# Altium schematic sheet STM32F103VC+NAND_Flash.SchDoc
size A4
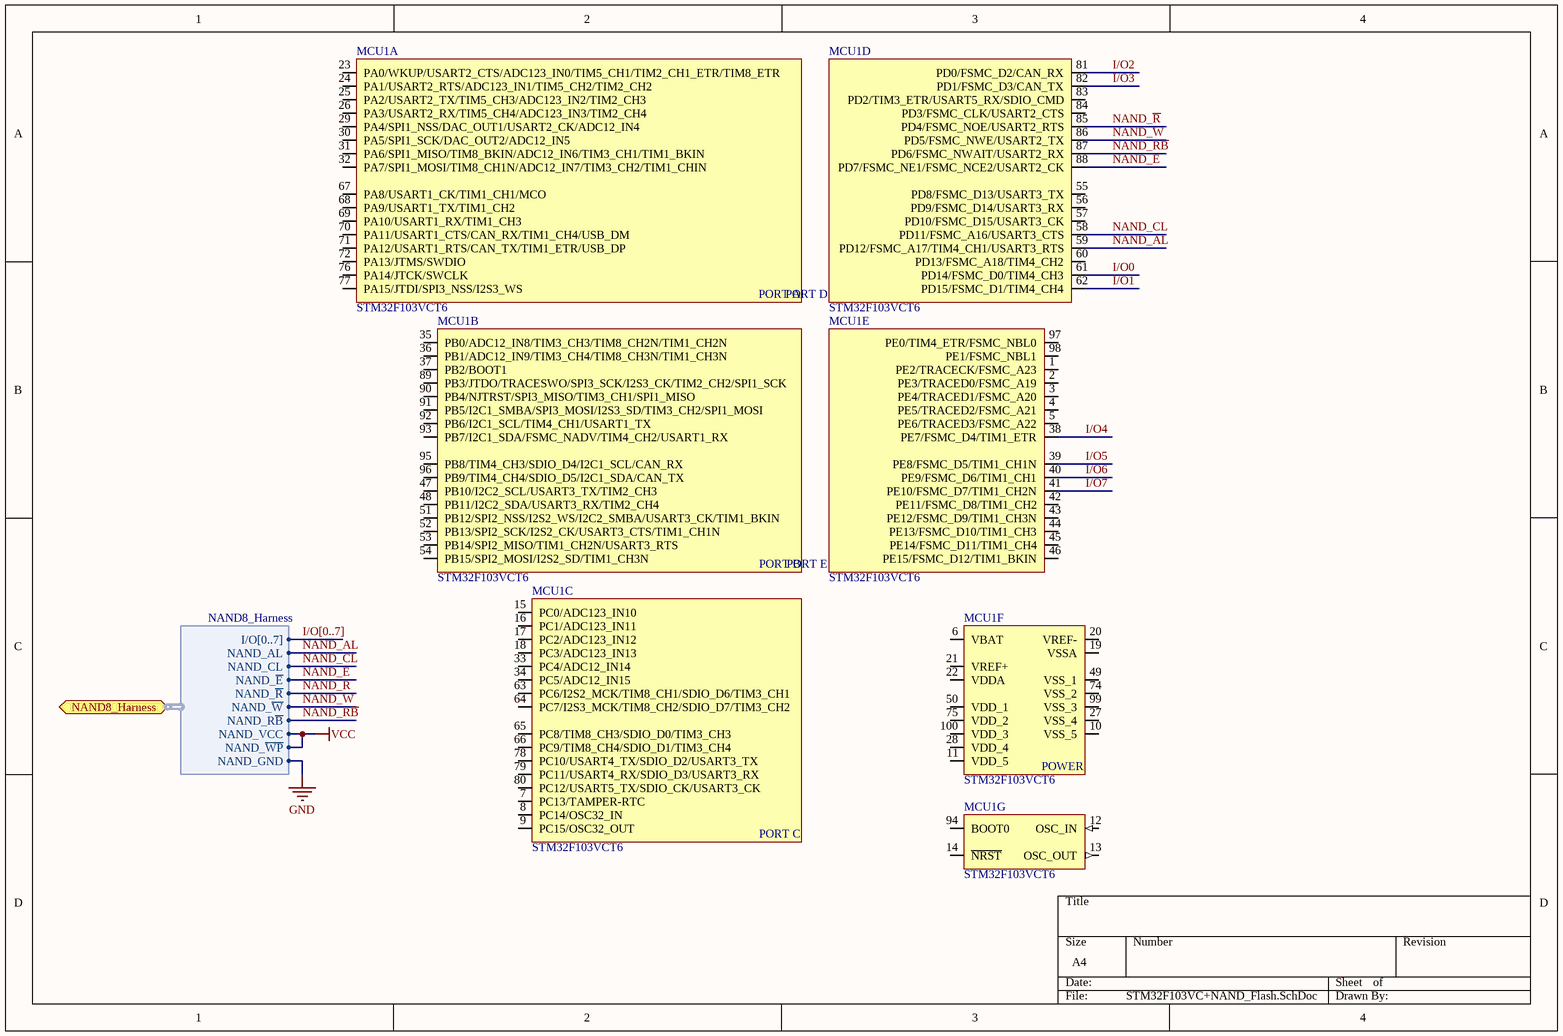
[diagram p0: STM32F103VC+NAND_Flash.SchDoc]

## Parts
MCU1  STM32F103VCT6  [LQFP100]  (parts A,B,C,D,E,F,G of 7)

## Ports
NAND8_Harness (harness NAND8_Harness)

## Harnesses
NAND8_Harness: I/O[0..7], NAND_AL, NAND_CL, NAND_~{E}, NAND_GND, NAND_~{R}, NAND_R~{B}, NAND_VCC, NAND_~{W}, NAND_~{WP}

## Nets
GND: port NAND8_Harness.NAND_GND
VCC: port NAND8_Harness.NAND_VCC, port NAND8_Harness.NAND_~{WP}
I/O0: MCU1.61(PD14/FSMC_D0/TIM4_CH3)
I/O1: MCU1.62(PD15/FSMC_D1/TIM4_CH4)
I/O2: MCU1.81(PD0/FSMC_D2/CAN_RX)
I/O3: MCU1.82(PD1/FSMC_D3/CAN_TX)
I/O4: MCU1.38(PE7/FSMC_D4/TIM1_ETR)
I/O5: MCU1.39(PE8/FSMC_D5/TIM1_CH1N)
I/O6: MCU1.40(PE9/FSMC_D6/TIM1_CH1)
I/O7: MCU1.41(PE10/FSMC_D7/TIM1_CH2N)
NAND_AL: MCU1.59(PD12/FSMC_A17/TIM4_CH1/USART3_RTS) ; port NAND8_Harness.NAND_AL
NAND_CL: MCU1.58(PD11/FSMC_A16/USART3_CTS) ; port NAND8_Harness.NAND_CL
NAND_~{E}: MCU1.88(PD7/FSMC_NE1/FSMC_NCE2/USART2_CK) ; port NAND8_Harness.NAND_~{E}
NAND_~{R}: MCU1.85(PD4/FSMC_NOE/USART2_RTS) ; port NAND8_Harness.NAND_~{R}
NAND_R~{B}: MCU1.87(PD6/FSMC_NWAIT/USART2_RX) ; port NAND8_Harness.NAND_R~{B}
NAND_~{W}: MCU1.86(PD5/FSMC_NWE/USART2_TX) ; port NAND8_Harness.NAND_~{W}

Not connected (* = marked no-connect by the designer): MCU1 1(PE2/TRACECK/FSMC_A23) 2(PE3/TRACED0/FSMC_A19) 3(PE4/TRACED1/FSMC_A20) 4(PE5/TRACED2/FSMC_A21) 5(PE6/TRACED3/FSMC_A22) 6(VBAT) 7(PC13/TAMPER-RTC) 8(PC14/OSC32_IN) 9(PC15/OSC32_OUT) 10(VSS_5) 11(VDD_5) 12(OSC_IN) 13(OSC_OUT) 14(~{NRST}) 15(PC0/ADC123_IN10) 16(PC1/ADC123_IN11) 17(PC2/ADC123_IN12) 18(PC3/ADC123_IN13) 19(VSSA) 20(VREF-) 21(VREF+) 22(VDDA) 23(PA0/WKUP/USART2_CTS/ADC123_IN0/TIM5_CH1/TIM2_CH1_ETR/TIM8_ETR) 24(PA1/USART2_RTS/ADC123_IN1/TIM5_CH2/TIM2_CH2) 25(PA2/USART2_TX/TIM5_CH3/ADC123_IN2/TIM2_CH3) 26(PA3/USART2_RX/TIM5_CH4/ADC123_IN3/TIM2_CH4) 27(VSS_4) 28(VDD_4) 29(PA4/SPI1_NSS/DAC_OUT1/USART2_CK/ADC12_IN4) 30(PA5/SPI1_SCK/DAC_OUT2/ADC12_IN5) 31(PA6/SPI1_MISO/TIM8_BKIN/ADC12_IN6/TIM3_CH1/TIM1_BKIN) 32(PA7/SPI1_MOSI/TIM8_CH1N/ADC12_IN7/TIM3_CH2/TIM1_CHIN) 33(PC4/ADC12_IN14) 34(PC5/ADC12_IN15) 35(PB0/ADC12_IN8/TIM3_CH3/TIM8_CH2N/TIM1_CH2N) 36(PB1/ADC12_IN9/TIM3_CH4/TIM8_CH3N/TIM1_CH3N) 37(PB2/BOOT1) 42(PE11/FSMC_D8/TIM1_CH2) 43(PE12/FSMC_D9/TIM1_CH3N) 44(PE13/FSMC_D10/TIM1_CH3) 45(PE14/FSMC_D11/TIM1_CH4) 46(PE15/FSMC_D12/TIM1_BKIN) 47(PB10/I2C2_SCL/USART3_TX/TIM2_CH3) 48(PB11/I2C2_SDA/USART3_RX/TIM2_CH4) 49(VSS_1) 50(VDD_1) 51(PB12/SPI2_NSS/I2S2_WS/I2C2_SMBA/USART3_CK/TIM1_BKIN) 52(PB13/SPI2_SCK/I2S2_CK/USART3_CTS/TIM1_CH1N) 53(PB14/SPI2_MISO/TIM1_CH2N/USART3_RTS) 54(PB15/SPI2_MOSI/I2S2_SD/TIM1_CH3N) 55(PD8/FSMC_D13/USART3_TX) 56(PD9/FSMC_D14/USART3_RX) 57(PD10/FSMC_D15/USART3_CK) 60(PD13/FSMC_A18/TIM4_CH2) 63(PC6/I2S2_MCK/TIM8_CH1/SDIO_D6/TIM3_CH1) 64(PC7/I2S3_MCK/TIM8_CH2/SDIO_D7/TIM3_CH2) 65(PC8/TIM8_CH3/SDIO_D0/TIM3_CH3) 66(PC9/TIM8_CH4/SDIO_D1/TIM3_CH4) 67(PA8/USART1_CK/TIM1_CH1/MCO) 68(PA9/USART1_TX/TIM1_CH2) 69(PA10/USART1_RX/TIM1_CH3) 70(PA11/USART1_CTS/CAN_RX/TIM1_CH4/USB_DM) 71(PA12/USART1_RTS/CAN_TX/TIM1_ETR/USB_DP) 72(PA13/JTMS/SWDIO) 74(VSS_2) 75(VDD_2) 76(PA14/JTCK/SWCLK) 77(PA15/JTDI/SPI3_NSS/I2S3_WS) 78(PC10/USART4_TX/SDIO_D2/USART3_TX) 79(PC11/USART4_RX/SDIO_D3/USART3_RX) 80(PC12/USART5_TX/SDIO_CK/USART3_CK) 83(PD2/TIM3_ETR/USART5_RX/SDIO_CMD) 84(PD3/FSMC_CLK/USART2_CTS) 89(PB3/JTDO/TRACESWO/SPI3_SCK/I2S3_CK/TIM2_CH2/SPI1_SCK) 90(PB4/NJTRST/SPI3_MISO/TIM3_CH1/SPI1_MISO) 91(PB5/I2C1_SMBA/SPI3_MOSI/I2S3_SD/TIM3_CH2/SPI1_MOSI) 92(PB6/I2C1_SCL/TIM4_CH1/USART1_TX) 93(PB7/I2C1_SDA/FSMC_NADV/TIM4_CH2/USART1_RX) 94(BOOT0) 95(PB8/TIM4_CH3/SDIO_D4/I2C1_SCL/CAN_RX) 96(PB9/TIM4_CH4/SDIO_D5/I2C1_SDA/CAN_TX) 97(PE0/TIM4_ETR/FSMC_NBL0) 98(PE1/FSMC_NBL1) 99(VSS_3) 100(VDD_3)

## Buses and harness runs
bus I/O[0..7]

## Notes on the sheet
- (in symbol STM32F103VCT6, part A) PORT A
- (in symbol STM32F103VCT6, part B) PORT B
- (in symbol STM32F103VCT6, part C) PORT C
- (in symbol STM32F103VCT6, part D) PORT D
- (in symbol STM32F103VCT6, part E) PORT E
- (in symbol STM32F103VCT6, part F) POWER